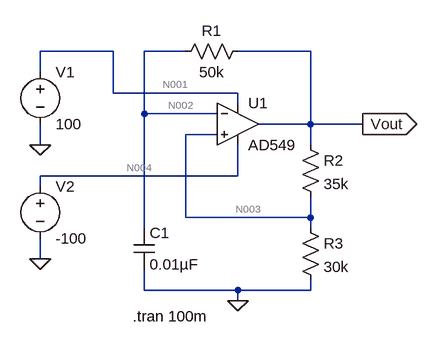
[diagram p0: schematic Draft2.asc]
Draft2.asc, the LTspice schematic file:
Version 4
SHEET 1 880 680
WIRE 80 -16 -32 -16
WIRE 192 -16 128 -16
WIRE 384 -16 272 -16
WIRE -32 16 -32 -16
WIRE 80 48 80 -16
WIRE 272 48 80 48
WIRE 272 64 272 48
WIRE 128 80 128 -16
WIRE 240 80 128 80
WIRE 384 96 384 -16
WIRE 384 96 304 96
WIRE 464 96 384 96
WIRE 240 112 192 112
WIRE -32 128 -32 96
WIRE 384 128 384 96
WIRE 272 176 272 128
WIRE 272 176 -32 176
WIRE -32 192 -32 176
WIRE 192 240 192 112
WIRE 384 240 384 208
WIRE 384 240 192 240
WIRE 128 256 128 80
WIRE 384 256 384 240
WIRE -32 304 -32 272
WIRE 128 352 128 320
WIRE 272 352 128 352
WIRE 384 352 384 336
WIRE 384 352 272 352
WIRE 272 368 272 352
FLAG 272 368 0
FLAG 464 96 Vout
IOPIN 464 96 Out
FLAG -32 128 0
FLAG -32 304 0
SYMBOL res 288 -32 R90
WINDOW 0 0 56 VBottom 2
WINDOW 3 32 56 VTop 2
SYMATTR InstName R1
SYMATTR Value 50k
SYMBOL res 368 112 R0
SYMATTR InstName R2
SYMATTR Value 35k
SYMBOL res 368 240 R0
SYMATTR InstName R3
SYMATTR Value 30k
SYMBOL voltage -32 0 R0
SYMATTR InstName V1
SYMATTR Value 100
SYMBOL voltage -32 176 R0
SYMATTR InstName V2
SYMATTR Value -100
SYMBOL Opamps\\AD549 272 32 R0
SYMATTR InstName U1
SYMBOL cap 112 256 R0
SYMATTR InstName C1
SYMATTR Value 0.01µF
TEXT 110 392 Left 2 !.tran 100m

The netlist it stands for:
* Draft2.asc
R1 Vout N002 50k
R2 Vout N003 35k
R3 N003 0 30k
V1 N001 0 100
V2 N004 0 -100
XU1 N003 N002 N001 N004 Vout AD549  ; pins In+ In- V+ V- OUT
C1 N002 0 0.01µF
.tran 100m
.backanno
.end

* Results of the author's LTspice run, read from the files saved beside the schematic
* Operating Point, zero values left out:
*   V(vout) = -666.6 nV
*   V(n002) = -666.6 nV
*   V(n003) = -307.7 nV
*   V(n001) = 100 V
*   V(n004) = -100 V
*   I(R3) = -10.26 pA
*   I(R2) = -10.26 pA
*   I(V2) = 794.4 µA
*   I(V1) = -794.4 µA
*   Ix(u1:3) = 794.4 µA
*   Ix(u1:4) = -794.4 µA
*   Ix(u1:5) = 10.13 pA
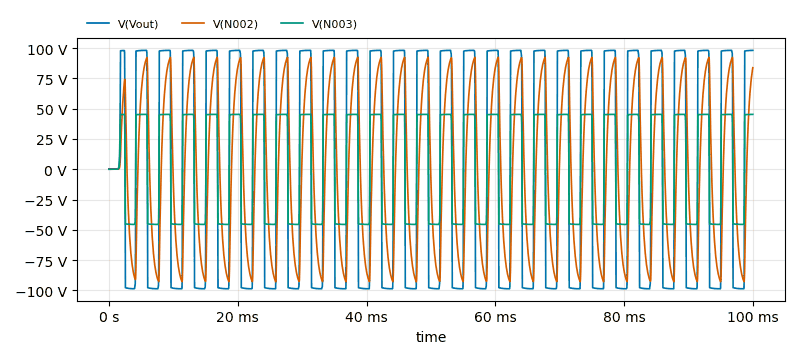
[diagram p1: Transient Analysis of Draft2.asc, plotted from the saved traces]
* Transient Analysis, 1 run:
*   V(Vout): min -98.7 V, max 98.1 V, average 372.7 mV, rms 95.6 V, last 98.08 V
*   V(N002): min -92.9 V, max 92.41 V, average -51.21 mV, rms 66.99 V, last 83.78 V
*   V(N003): min -45.56 V, max 45.28 V, average 172 mV, rms 44.12 V, last 45.27 V